# EAGLE schematic CamController (EAGLE 9.1.3)
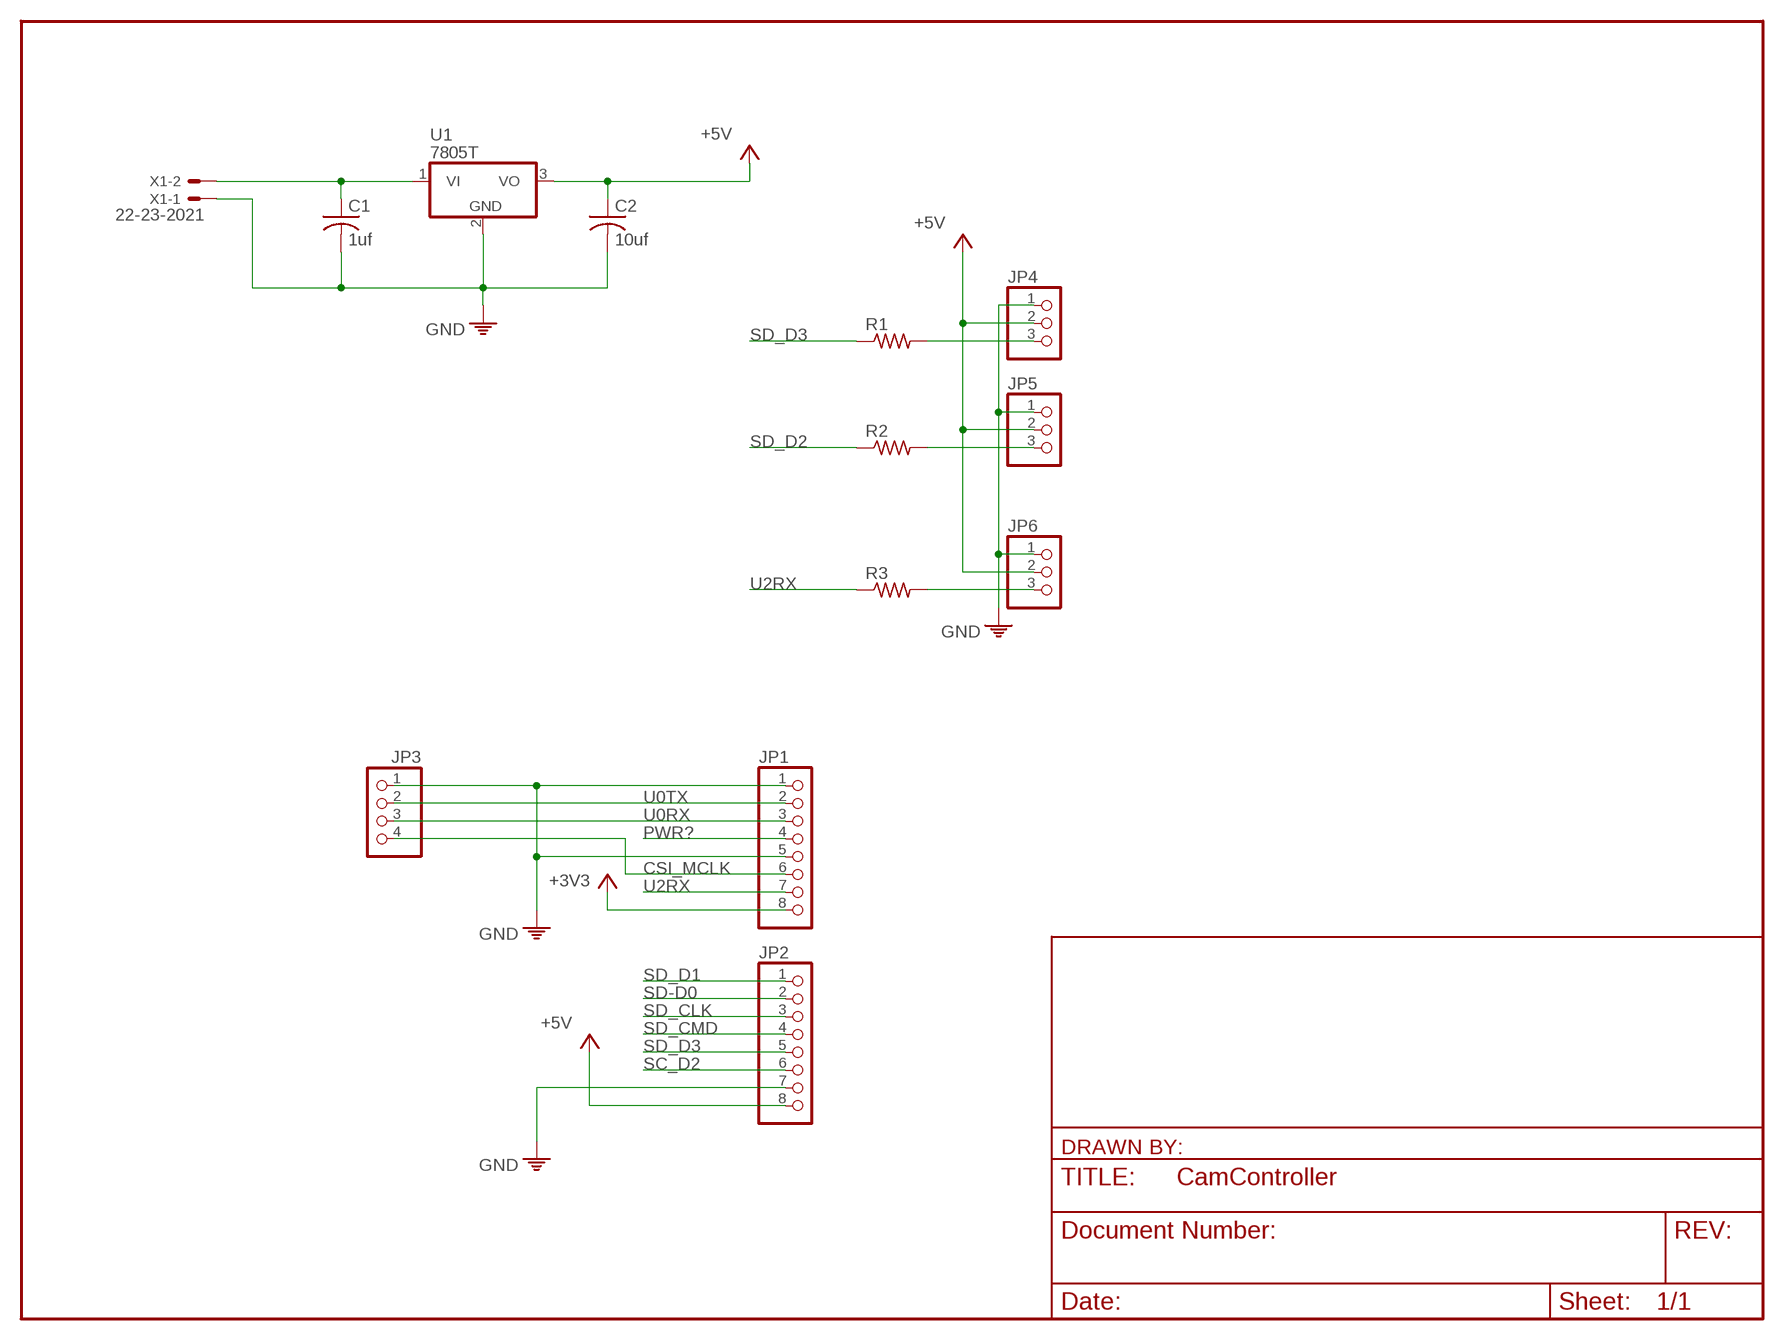
[diagram p0: schematic, sheet 1]

## Parts
C1  1uf  C-US025-040X050  [C025-040X050]
C2  10uf  C-US025-030X050  [C025-030X050]
JP1  PINHD-1X8  [1X08]
JP2  PINHD-1X8  [1X08]
JP3  PINHD-1X4  [1X04]
JP4  PINHD-1X3/90  [1X03/90]
JP5  PINHD-1X3/90  [1X03/90]
JP6  PINHD-1X3/90  [1X03/90]
R1  R-US_0309/10  [0309/10]
R2  R-US_0309/10  [0309/10]
R3  R-US_0309/10  [0309/10]
U1  7805T  [TO220H]
X1  22-23-2021  [22-23-2021]

## Nets
+3V3: JP1.8
+5V: C2.1 JP2.8 JP4.2 JP5.2 JP6.2 U1.3(VO)
CSI_MCLK: JP1.6 JP3.4
GND: C1.2 C2.2 JP1.1 JP1.5 JP2.7 JP3.1 U1.2(GND) X1.1
N$1: C1.1 U1.1(VI) X1.2
N$3: JP5.3 R2.2
N$4: JP6.3 R3.2
PE: JP4.1 JP5.1 JP6.1 ; supply symbol labelled GND
PWR?: JP1.4
SC_D2: JP2.6
SD-D0: JP2.2
SD_CLK: JP2.3
SD_CMD: JP2.4
SD_D1: JP2.1
SD_D2: R2.1
SD_D3: JP2.5 JP4.3 R1.1 R1.2
U0RX: JP1.3 JP3.3
U0TX: JP1.2 JP3.2
U2RX: JP1.7 R3.1

## Library data of the parts
C1 C2 = _rcl:C-US: CAPACITOR, American symbol
JP1 JP2 = _pinhead:PINHD-1X8: PIN HEADER
JP3 = pinhead:PINHD-1X4: PIN HEADER
JP4-JP6 = pinhead:PINHD-1X3: PIN HEADER
R1-R3 = _rcl:R-US_: RESISTOR, American symbol
U1 = _linear:78*: Positive VOLTAGE REGULATOR Source: http://cache.national.com/ds/LM/LM78L05.pdf http://www.fairchildsemi.com/ds/LM/LM7805.pdf
X1 = _con-molex:22-23-2021: .100" (2.54mm) Center Header - 2 Pin